# EAGLE design plc-3u-a (EAGLE 4.16)
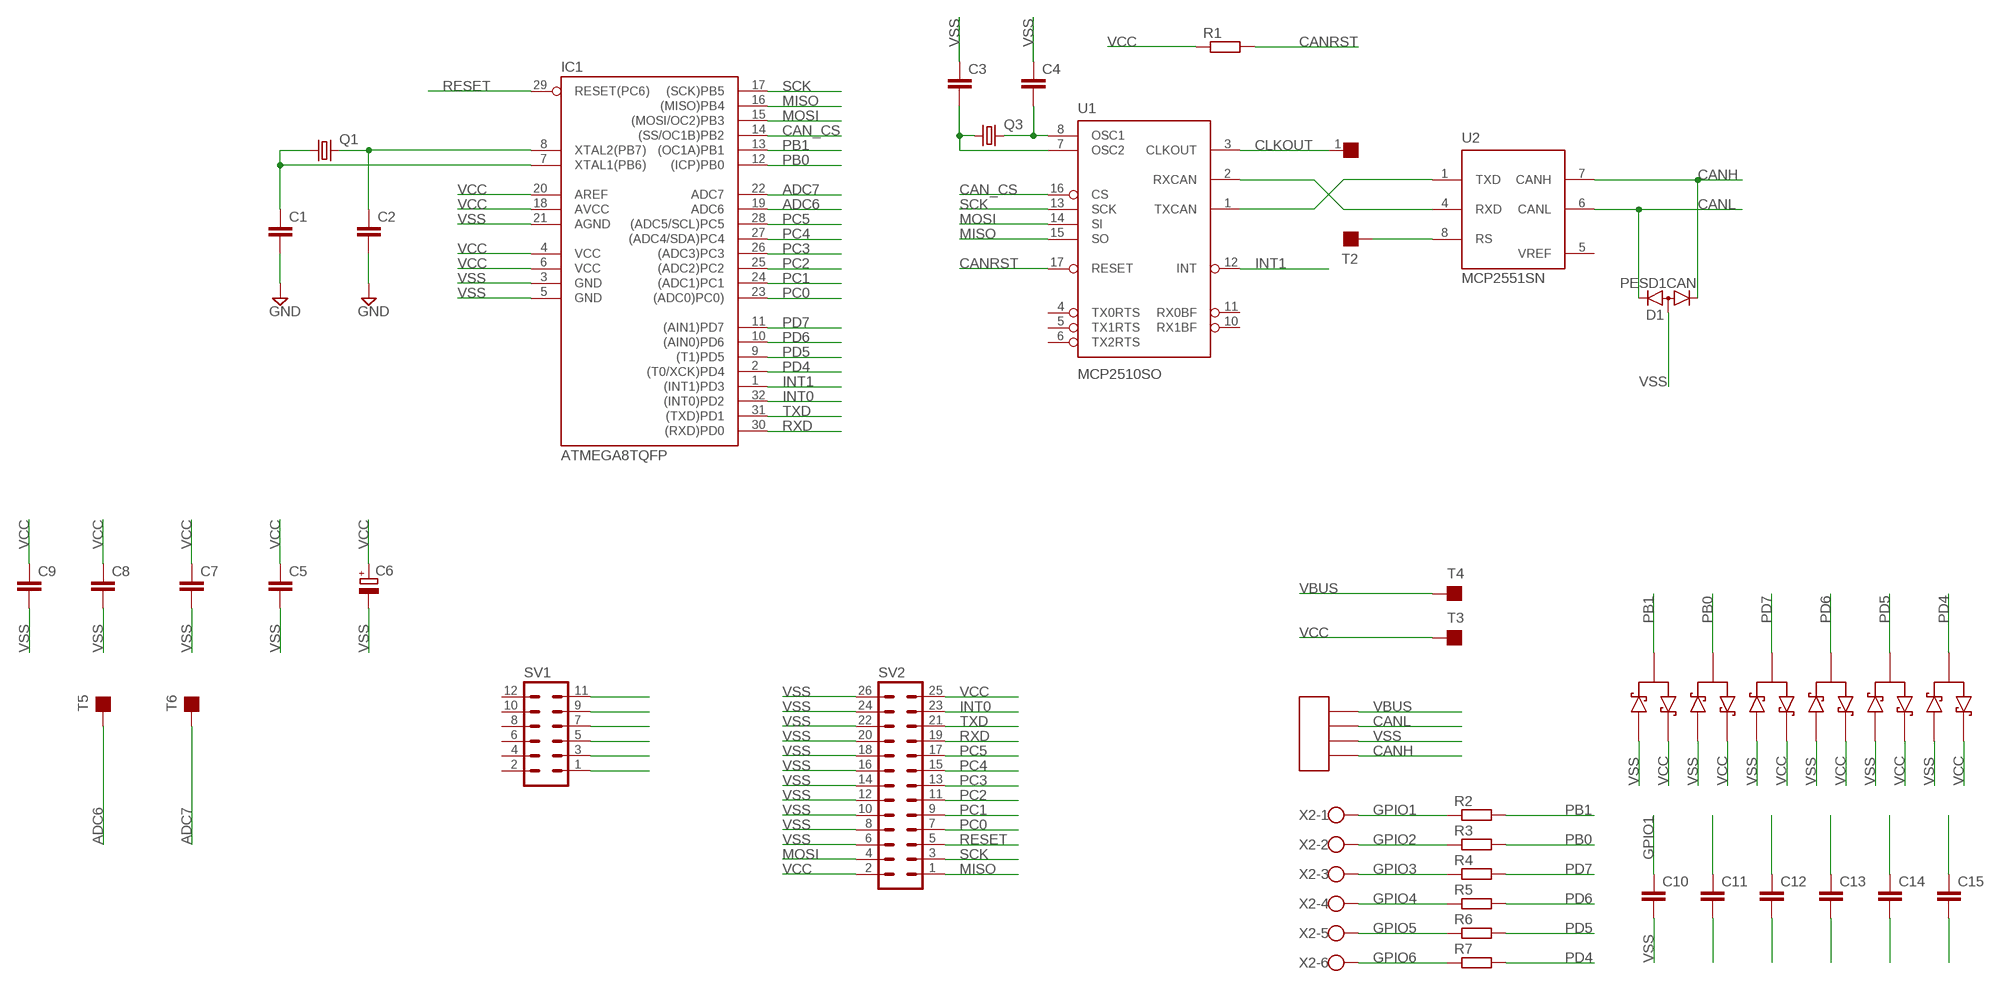
[diagram p0: schematic, sheet 1]

## Parts
C1  C-EUC0805  [C0805]
C2  C-EUC0805  [C0805]
C3  C-EUC0805  [C0805]
C4  C-EUC0805  [C0805]
C5  C-EUC0805  [C0805]
C6  CPOL-EUE2.5-5  [E2,5-5]
C7  C-EUC0805  [C0805]
C8  C-EUC0805  [C0805]
C9  C-EUC0805  [C0805]
C10  C-EUC1206  [C1206]
C11  C-EUC1206  [C1206]
C12  C-EUC1206  [C1206]
C13  C-EUC1206  [C1206]
C14  C-EUC1206  [C1206]
C15  C-EUC1206  [C1206]
D1  PESD1CAN  DIODEK2ASOT-23  [SOT-23]
IC1  ATMEGA8TQFP  [TQFP32-08]
Q1  CRYSTALHC49S  [HC49/S]
Q3  CRYSTALHC49S  [HC49/S]
R1  R-EU_R0805  [R0805]
R2  R-EU_R1206  [R1206]
R3  R-EU_R1206  [R1206]
R4  R-EU_R1206  [R1206]
R5  R-EU_R1206  [R1206]
R6  R-EU_R1206  [R1206]
R7  R-EU_R1206  [R1206]
SV1  MA06-2  [MA06-2]
SV2  MA13-2W  [MA13-2W]
T1  TESTPOINT  [TESTPOIN]
T2  TESTPOINT  [TESTPOIN]
T3  TESTPOINT  [TESTPOIN]
T4  TESTPOINT  [TESTPOIN]
T5  TESTPOINT  [TESTPOIN]
T6  TESTPOINT  [TESTPOIN]
U1  MCP2510SO  [SO-18W]
U2  MCP2551SN  [SO-08]
U$1  BAT54S  [SOT23]
U$2  BAT54S  [SOT23]
U$3  PIN_HEADER_2X2  [PIN_HEADER_2X2]
U$4  BAT54S  [SOT23]
U$5  BAT54S  [SOT23]
U$6  BAT54S  [SOT23]
U$7  BAT54S  [SOT23]
X2  W237-06P  [W237-6P]

## Nets
ADC6: IC1.19(ADC6) T5.1
ADC7: IC1.22(ADC7) T6.1
CAN_CS: IC1.14((SS/OC1B)PB2) U1.16(CS)
CANH: D1.1(K1) U2.7(CANH) U$3.P$4
CANL: D1.2(K2) U2.6(CANL) U$3.P$2
CANRST: R1.2 U1.17(RESET)
CLKOUT: T1.1 U1.3(CLKOUT)
GPIO1: C10.1 R2.1 X2.1
GPIO2: C11.1 R3.1 X2.2
GPIO3: C12.1 R4.1 X2.3
GPIO4: C13.1 R5.1 X2.4
GPIO5: C14.1 R6.1 X2.5
GPIO6: C15.1 R7.1 X2.6
INT0: IC1.32((INT0)PD2) SV2.23
INT1: IC1.1((INT1)PD3) U1.12(INT)
MISO: IC1.16((MISO)PB4) SV2.1 U1.15(SO)
MOSI: IC1.15((MOSI/OC2)PB3) SV2.4 U1.14(SI)
N$3: C4.2 Q3.2 U1.8(OSC1)
N$4: C3.2 Q3.1 U1.7(OSC2)
PB0: IC1.12((ICP)PB0) R3.2 SV1.3 U$2.3(MID)
PB1: IC1.13((OC1A)PB1) R2.2 SV1.1 U$1.3(MID)
PB6: C2.1 IC1.8(XTAL2(PB7)) Q1.2
PB7: C1.1 IC1.7(XTAL1(PB6)) Q1.1
PC0: IC1.23((ADC0)PC0)) SV2.7
PC1: IC1.24((ADC1)PC1) SV2.9
PC2: IC1.25((ADC2)PC2) SV2.11
PC3: IC1.26((ADC3)PC3) SV2.13
PC4: IC1.27((ADC4/SDA)PC4) SV2.15
PC5: IC1.28((ADC5/SCL)PC5) SV2.17
PD4: IC1.2((T0/XCK)PD4) R7.2 SV1.11 U$7.3(MID)
PD5: IC1.9((T1)PD5) R6.2 SV1.9 U$6.3(MID)
PD6: IC1.10((AIN0)PD6) R5.2 SV1.7 U$5.3(MID)
PD7: IC1.11((AIN1)PD7) R4.2 SV1.5 U$4.3(MID)
RESET: IC1.29(RESET(PC6)) SV2.5
RS: T2.1 U2.8(RS)
RX: U1.2(RXCAN) U2.4(RXD)
RXD: IC1.30((RXD)PD0) SV2.19
SCK: IC1.17((SCK)PB5) SV2.3 U1.13(SCK)
TX: U1.1(TXCAN) U2.1(TXD)
TXD: IC1.31((TXD)PD1) SV2.21
VBUS: T4.1 U$3.P$1
VCC: C5.1 C6.+ C7.1 C8.1 C9.1 IC1.4(VCC) IC1.6(VCC) IC1.18(AVCC) IC1.20(AREF) R1.1 SV2.2 SV2.25 T3.1 U$1.2(DST) U$2.2(DST) U$4.2(DST) U$5.2(DST) U$6.2(DST) U$7.2(DST)
VSS: C1.2 C2.2 C3.1 C4.1 C5.2 C6.- C7.2 C8.2 C9.2 C10.2 C11.2 C12.2 C13.2 C14.2 C15.2 D1.3(A) IC1.3(GND) IC1.5(GND) IC1.21(AGND) SV2.6 SV2.8 SV2.10 SV2.12 SV2.14 SV2.16 SV2.18 SV2.20 SV2.22 SV2.24 SV2.26 U$1.1(SRC) U$2.1(SRC) U$3.P$3 U$4.1(SRC) U$5.1(SRC) U$6.1(SRC) U$7.1(SRC) ; supply symbol labelled GND
Unconnected: SV1.2 SV1.4 SV1.6 SV1.8 SV1.10 SV1.12 U1.4(TX0RTS) U1.5(TX1RTS) U1.6(TX2RTS) U1.10(RX1BF) U1.11(RX0BF)

## Power pins joined to a net without a drawn wire
VCC: U1.18(VDD) U2.3(VDD)
VREF: U2.5(VREF)
VSS: U1.9(VSS) U2.2(VSS)

## Library data of the parts
C1-C5 C7-C15 = rcl:C-EU: CAPACITOR, European symbol
C6 = rcl:CPOL-EU: POLARIZED CAPACITOR, European symbol
D1 = ads4:DIODEK2A: Diode package with 2 cathodes (e.g., BAT54A)
IC1 = ads4:ATMEGA8TQFP: Atmel ATmega8 in the TQFP package
Q1 Q3 = crystal:CRYSTAL: CRYSTAL
R1-R7 = rcl:R-EU_: RESISTOR, European symbol
SV1 = con-lstb:MA06-2: PIN HEADER
SV2 = con-lstb:MA13-2W: PIN HEADER
T1 = ADS:TESTPOINT
T2-T6 = ads4:TESTPOINT: Test point
U1 = microchip_can:MCP2510
U2 = microchip_can:MCP2551: High Speed CAN tranceiver
U$1 U$2 U$4-U$7 = my-protection:BAT54S
U$3 = my:PIN_HEADER_2X2
X2 = con-wago-508:W237-06P: WAGO SREW CLAMP

## Board
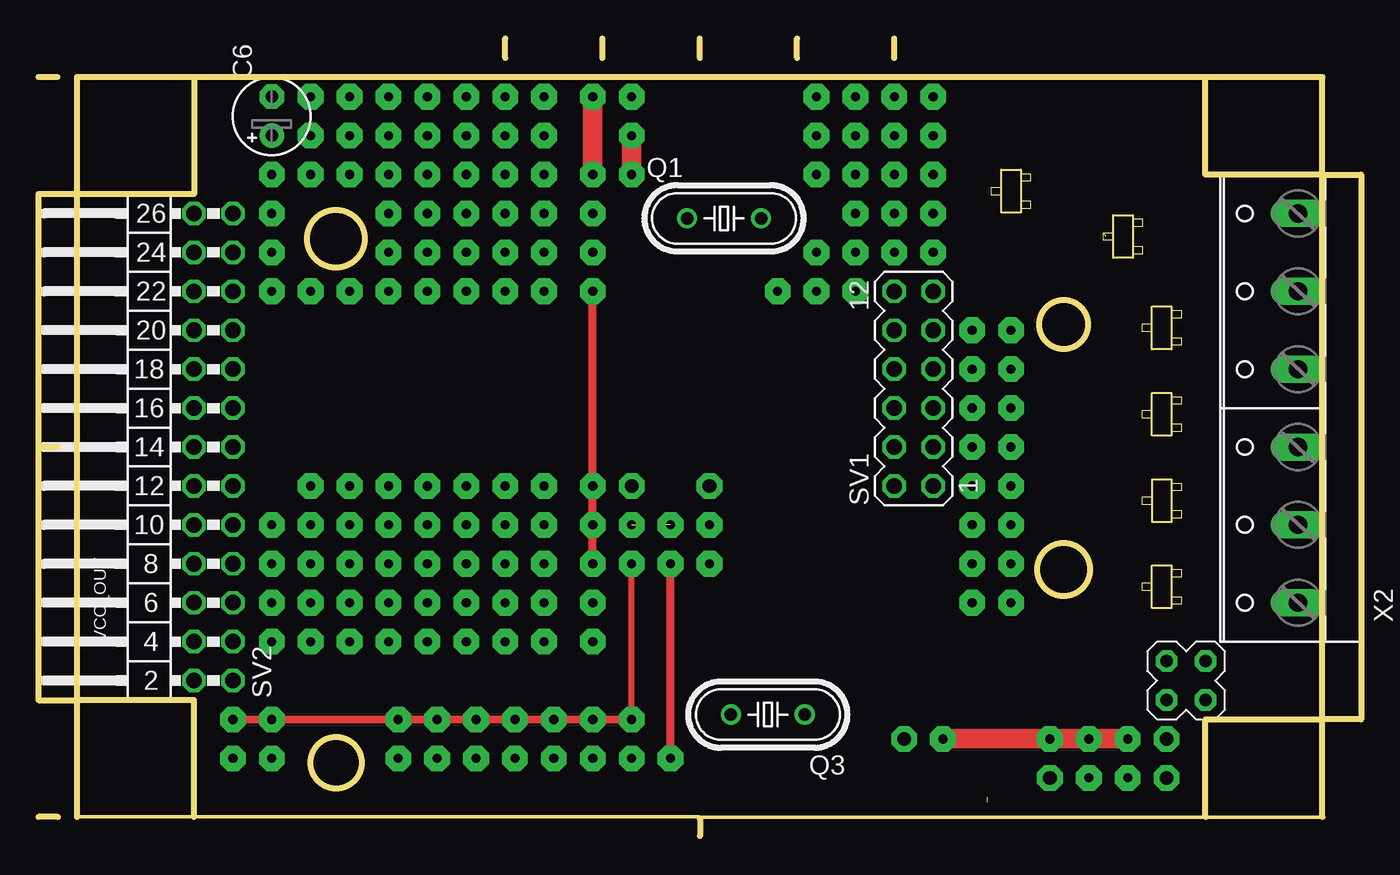
[diagram p1: board, top side]
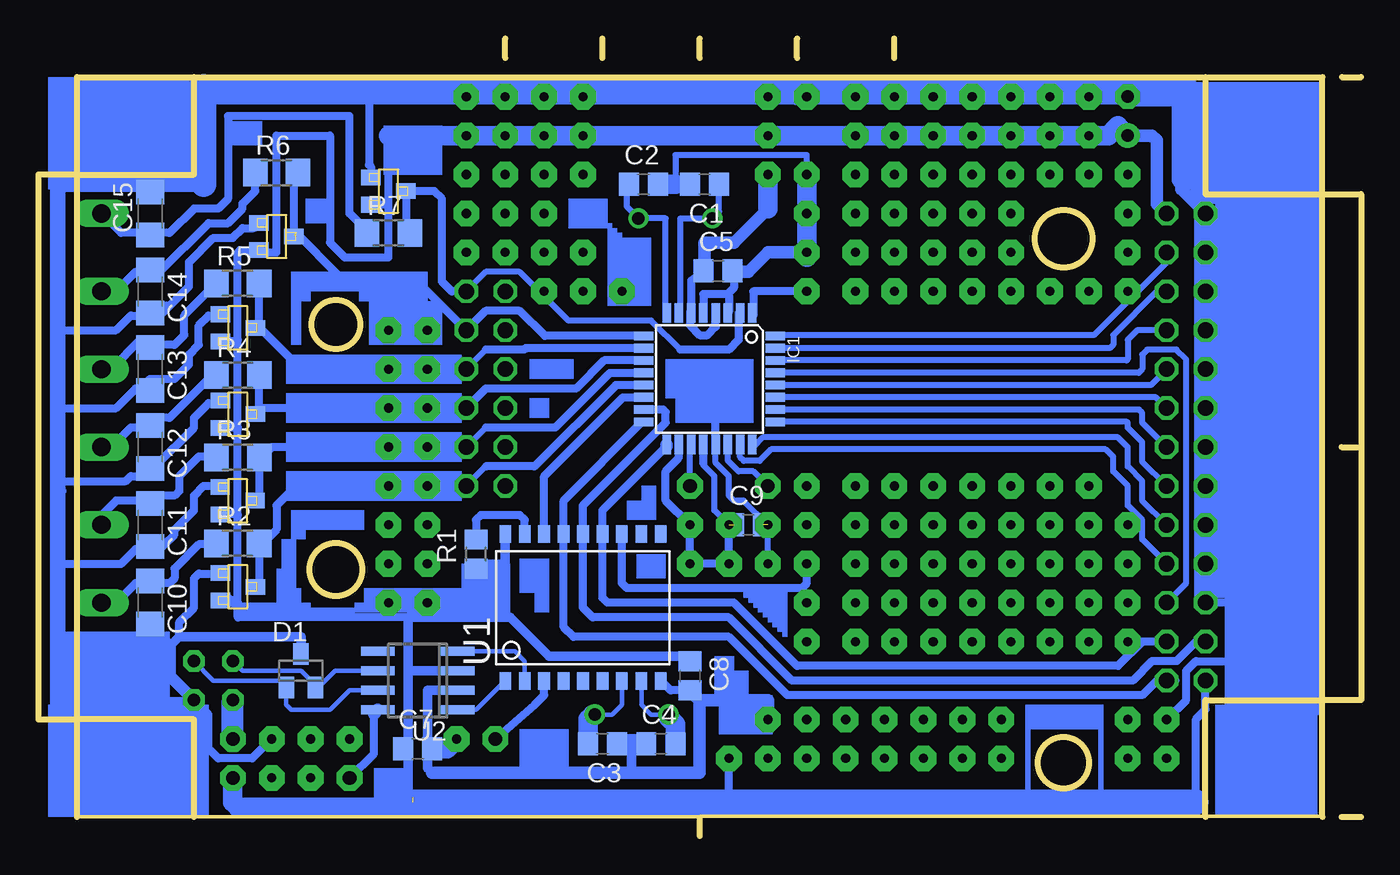
[diagram p2: board, bottom side, seen from below]

Size 86.36 x 52.07 mm. Coordinates in mm from the lower left corner, seen from the top.
Outline: 2.54,1.29 83.82,1.25
Outline: 43.18,1.13 43.18,0
Outline: 1.27,49.53 0,49.53
Outline: 1.27,1.27 0,1.27
Outline: 1.27,25.4 0,25.4
Outline: 2.54,1.27 2.54,8.89
Outline: 2.54,8.89 2.54,41.91
Outline: 2.54,41.91 2.54,49.53 10.16,49.53
Outline: 83.82,1.27 83.82,7.62
Outline: 83.82,7.62 83.82,43.18
Outline: 83.82,43.18 83.82,49.53 76.2,49.53
Outline: 76.2,49.53 10.16,49.53
Outline: 10.16,1.27 10.16,8.89 2.54,8.89
Outline: 76.2,1.27 76.2,7.62 83.82,7.62
Outline: 83.82,43.18 76.2,43.18 76.2,49.53
Outline: 10.16,49.53 10.16,41.91 2.54,41.91
Outline: 2.54,41.91 0,41.91 0,8.89 2.54,8.89
Outline: 83.82,43.18 86.36,43.18 86.36,7.62 83.82,7.62
Outline: 43.18,50.8 43.18,52.07
Outline: 49.53,50.8 49.53,52.07
Outline: 55.88,50.8 55.88,52.07
Outline: 36.83,50.8 36.83,52.07
Outline: 30.48,50.8 30.48,52.07
Outline: circle at 19.43,39 radius 1.86
Outline: circle at 19.43,4.8 radius 1.66
Outline: circle at 66.93,17.4 radius 1.71
Outline: circle at 66.93,33.4 radius 1.57
Copper layers (1*16): Top 0.035mm / dielectric 1.5mm / Bottom 0.035mm
Design rules "default": minimum track width 10mil, minimum drill 24mil, track to track 8mil, track to pad 8mil, pad to pad 8mil, via to via 8mil, smd to smd 8mil, copper to edge 40mil, drill to drill 8mil, minimum pad ring 10mil, minimum via ring 8mil, stop-mask expansion 4mil, vias tented up to drill 0mil, thermal gap 10mil

### Footprints (pad centres in the part's own frame; a part is rotated, then mirrored left to right if it is on the bottom)
C0805 = smd 1.3 x 1.5: 1 -0.95,0; 2 0.95,0
E2,5-5 = drill 0.813 pad 1.6 round: + -1.27,0 | drill 0.813 pad 1.6 octagon: - 1.27,0
C1206 = smd 1.6 x 1.8: 1 -1.4,0; 2 1.4,0
SOT-23 = smd 1 x 1.4: 1 -0.95,-1.1; 2 0.95,-1.1; 3 0,1.1
TQFP32-08 = smd 1.27 x 0.559: 1 -4.293,2.8; 2 -4.293,2; 3 -4.293,1.2; 4 -4.293,0.4; 5 -4.293,-0.4; 6 -4.293,-1.2; 7 -4.293,-2; 8 -4.293,-2.8; 17 4.293,-2.8; 18 4.293,-2; 19 4.293,-1.2; 20 4.293,-0.4; 21 4.293,0.4; 22 4.293,1.2; 23 4.293,2; 24 4.293,2.8 | smd 0.559 x 1.27: 9 -2.8,-4.293; 10 -2,-4.293; 11 -1.2,-4.293; 12 -0.4,-4.293; 13 0.4,-4.293; 14 1.2,-4.293; 15 2,-4.293; 16 2.8,-4.293; 25 2.8,4.293; 26 2,4.293; 27 1.2,4.293; 28 0.4,4.293; 29 -0.4,4.293; 30 -1.2,4.293; 31 -2,4.293; 32 -2.8,4.293
HC49/S = drill 0.813 round: 1 -2.413,0; 2 2.413,0
R0805 = smd 1.3 x 1.5: 1 -0.95,0; 2 0.95,0
R1206 = smd 1.6 x 1.8: 1 -1.4,0; 2 1.4,0
MA06-2 = drill 1.016 octagon: 1 -6.35,-1.27; 2 -6.35,1.27; 3 -3.81,-1.27; 4 -3.81,1.27; 5 -1.27,-1.27; 6 -1.27,1.27; 7 1.27,-1.27; 8 1.27,1.27; 9 3.81,-1.27; 10 3.81,1.27; 11 6.35,-1.27; 12 6.35,1.27
MA13-2W = drill 1.016 octagon: 1 -15.24,-1.27; 2 -15.24,1.27; 3 -12.7,-1.27; 4 -12.7,1.27; 5 -10.16,-1.27; 6 -10.16,1.27; 7 -7.62,-1.27; 8 -7.62,1.27; 9 -5.08,-1.27; 10 -5.08,1.27; 11 -2.54,-1.27; 12 -2.54,1.27; 13 0,-1.27; 14 0,1.27; 15 2.54,-1.27; 16 2.54,1.27; 17 5.08,-1.27; 18 5.08,1.27; 19 7.62,-1.27; 20 7.62,1.27; 21 10.16,-1.27; 22 10.16,1.27; 23 12.7,-1.27; 24 12.7,1.27; 25 15.24,-1.27; 26 15.24,1.27
TESTPOIN = drill 0.889 pad 1.676 octagon: 1 0,0
SO-18W = smd 0.762 x 1.143: 1 -5.08,-4.788; 2 -3.81,-4.788; 3 -2.54,-4.788; 4 -1.27,-4.788; 5 0,-4.788; 6 1.27,-4.788; 7 2.54,-4.788; 8 3.81,-4.788; 9 5.08,-4.788; 10 5.08,4.788; 11 3.81,4.788; 12 2.54,4.788; 13 1.27,4.788; 14 0,4.788; 15 -1.27,4.788; 16 -2.54,4.788; 17 -3.81,4.788; 18 -5.08,4.788
SO-08 = smd 0.6 x 2.2: 1 -1.905,-2.6; 2 -0.635,-2.6; 3 0.635,-2.6; 4 1.905,-2.6; 5 1.905,2.6; 6 0.635,2.6; 7 -0.635,2.6; 8 -1.905,2.6
SOT23 = smd 1.016 x 1.27: 1 -0.889,-1.143; 2 0.889,-1.143; 3 0,1.143
PIN_HEADER_2X2 = drill 0.8 pad 1.422 octagon: P$1 -1.27,-1.27; P$2 -1.27,1.27; P$3 1.27,-1.27; P$4 1.27,1.27
W237-6P = drill 1.194 long: 1 -12.7,-0.635; 2 -7.62,-0.635; 3 -2.54,-0.635; 4 2.54,-0.635; 5 7.62,-0.635; 6 12.7,-0.635

### Placement (x,y rotation side)
C1  42.86,42.55 180 bottom
C2  46.85,42.55 0 bottom
C3  49.53,6.03 180 bottom
C4  45.72,6.03 0 bottom
C5  41.98,36.89 0 bottom
C6  15.24,46.99 90 top
C7  61.59,5.71 0 bottom
C8  43.81,10.48 270 bottom
C9  40.01,20.32 0 bottom
C10  79.06,15.24 270 bottom
C11  79.06,20.32 270 bottom
C12  79.06,25.4 270 bottom
C13  79.06,30.48 270 bottom
C14  79.06,35.56 270 bottom
C15  79.06,40.64 90 bottom
D1  69.22,10.79 0 bottom
IC1  42.55,29.84 270 bottom
Q1  44.77,40.32 0 top
Q3  47.62,7.94 180 top
R1  57.78,18.41 90 bottom
R2  73.34,19.11 0 bottom
R3  73.34,24.72 0 bottom
R4  73.34,30.09 0 bottom
R5  73.34,36.08 0 bottom
R6  70.8,43.3 0 bottom
R7  63.5,39.37 0 bottom
SV1  57.15,29.21 90 top
SV2  11.43,25.4 90 top
T1  56.52,6.35 0 top
T2  66.04,3.81 0 top
T3  73.66,3.81 0 top
T4  73.66,6.35 0 top
T5  43.81,22.86 0 top
T6  38.73,22.86 0 top
U1  50.8,14.92 0 bottom
U2  61.59,10.16 90 bottom
U$1  73.34,16.28 270 bottom
U$2  73.35,21.9 270 bottom
U$3  74.93,10.16 0 top
U$4  73.34,27.54 270 bottom
U$5  73.34,33.17 270 bottom
U$6  70.81,39.14 270 bottom
U$7  63.5,42.1 270 bottom
X2  81.6,27.94 90 top

### Tracks (layer width: path | path; a pad name or v marks a point on that pad's centre or on a via)
ADC6
  Bottom 0.406: IC1.19 43.74,25.47 43.81,25.4 T5.1
ADC7
  Bottom 0.406: IC1.22 41.34,24.52 40.64,23.81 39.69,23.81 T6.1
CAN_CS
  Bottom 0.508: IC1.14 48.19,28.64 53.34,23.5 U1.16 53.34,19.68
CANH
  Bottom 0.305: U2.7 66.04,9.53 67.31,8.26 69.85,8.26 70.17,8.57 70.17,9.53 D1.1 70.17,9.84 70.48,10.16 74.93,10.16 U$3.P$4
CANL
  Bottom 0.305: U2.6 66.99,10.79 68.26,9.53 68.27,9.53 D1.2 68.27,9.85 69.22,10.79 73.03,10.79 U$3.P$2
CANRST
  Bottom 0.508: U1.17 54.61,20.64 54.93,20.95 57.47,20.95 57.78,20.64 R1.2
CLKOUT
  Bottom 0.508: U1.3 53.34,9.21 53.98,8.57 T1.1
GPIO1
  Bottom 0.508: R2.1 74.74,19.18 74.93,19.37 75.25,19.05 75.88,19.05 77.47,17.46 77.47,16.83 77.79,16.51 79.06,16.51 | 79.06,16.51 C10.1 | 79.06,16.51 80.01,16.51 81.28,15.24 X2.1
GPIO2
  Bottom 0.508: 74.7,24.77 74.61,24.77 | R3.1 74.7,24.77 | 74.7,24.77 75.88,24.77 77.15,23.5 77.15,22.54 77.47,22.23 78.55,22.23 C11.1 79.25,21.91 81.28,21.91 82.23,20.95 X2.2
GPIO3
  Bottom 0.508: C12.1 79.19,26.67 80.33,26.67 81.28,25.72 81.28,25.4 X2.3 | 74.98,29.84 R4.1 74.67,30.16 | C12.1 79.06,26.67 | C12.1 78.55,27.3 77.79,27.3 74.93,30.16 74.67,30.16 | 74.67,30.16 74.61,30.16
GPIO4
  Bottom 0.508: 79.06,32.07 79.06,32.38 | X2.4 81.6,30.48 79.69,32.38 79.19,32.38 C13.1 79.06,32.07 | R5.1 76.84,33.99 76.84,32.7 77.47,32.07 79.06,32.07
GPIO5
  Bottom 0.508: R6.1 72.2,42.1 73.03,41.27 73.03,40.96 73.98,40.01 75.25,40.01 78.42,36.83 79.06,36.83 C14.1 79.19,36.83 80.01,36.83 81.28,35.56 X2.5
GPIO6
  Bottom 0.508: R7.1 64.9,39.5 66.04,40.64 66.04,46.99 73.98,46.99 73.98,41.59 74.61,40.96 76.2,40.96 77.79,39.37 79.06,39.37 C15.1 79.19,39.37 80.96,39.37 X2.6 81.92,40.96
INT0
  Bottom 0.406: SV2.23 12.7,37.47 17.46,32.7 38.1,32.7 38.16,32.65 IC1.32
INT1  (via drill 0.6 pad 1.68)
  Top 0.508: v36.2,17.78 v36.2,20.32 v36.2,22.86 v36.2,35.56
  Bottom 0.508: U1.12 48.26,16.51 47.94,16.19 36.51,16.19 36.2,16.51 v36.2,17.78 | 39.69,34.29 39.69,34.2 IC1.1 39.74,34.03 39.69,33.97 39.69,35.56 v36.2,35.56
MISO
  Bottom 0.406: SV2.1 12.07,10.16
  Bottom 0.508: IC1.16 46.93,27.05 52.07,21.91 U1.15 52.07,13.65 51.44,13.02 41.27,13.02 37.46,9.21 14.29,9.21 13.34,10.16 SV2.1
MOSI
  Bottom 0.508: IC1.15 46.81,27.84 46.8,27.84 45.56,27.84 45.4,27.68 45.4,26.99 50.8,21.59 U1.14 50.8,14.92 50.16,14.29 41.27,14.29 37.15,10.16 14.92,10.16 13.65,11.43 12.07,11.43 10.8,12.7 SV2.4
N$3
  Bottom 0.305: Q3.2 46.35,7.94 46.99,8.57 U1.8 46.99,10.16
  Bottom 1.27: Q3.2 45.21,7.75 44.77,7.3 C4.2
N$4
  Bottom 0.305: Q3.1 48.89,7.94 48.26,8.57 U1.7 48.26,10.16
  Bottom 1.27: Q3.1 50.16,7.94 50.48,7.62 C3.2
N$6  (via drill 0.6 pad 1.68)
  other vias: 43.81,17.78
N$7  (via drill 0.6 pad 1.68)
  other vias: 43.81,20.32
N$8  (via drill 0.6 pad 1.68)
  other vias: 33.02,48.26
N$9  (via drill 0.6 pad 1.68)
  other vias: 33.02,43.18
N$10  (via drill 0.6 pad 1.68)
  other vias: 38.73,48.26
N$11  (via drill 0.6 pad 1.68)
  other vias: 33.02,40.64
N$12  (via drill 0.6 pad 1.68)
  other vias: 33.02,38.1
N$13  (via drill 0.6 pad 1.68)
  other vias: 33.02,35.56
N$14  (via drill 0.6 pad 1.68)
  other vias: 30.48,35.56
N$15  (via drill 0.6 pad 1.68)
  other vias: 27.94,35.56
N$16  (via drill 0.6 pad 1.68)
  other vias: 25.4,35.56
N$17  (via drill 0.6 pad 1.68)
  other vias: 30.48,38.1
N$18  (via drill 0.6 pad 1.68)
  other vias: 30.48,40.64
N$19  (via drill 0.6 pad 1.68)
  other vias: 27.94,40.64
N$20  (via drill 0.6 pad 1.68)
  other vias: 27.94,38.1
N$21  (via drill 0.6 pad 1.68)
  other vias: 25.4,38.1
N$22  (via drill 0.6 pad 1.68)
  other vias: 25.4,40.64
N$23  (via drill 0.6 pad 1.68)
  other vias: 22.86,40.64
N$24  (via drill 0.6 pad 1.68)
  other vias: 22.86,38.1
N$25  (via drill 0.6 pad 1.68)
  other vias: 22.86,35.56
N$26  (via drill 0.6 pad 1.68)
  other vias: 20.32,35.56
N$27  (via drill 0.6 pad 1.68)
  other vias: 17.78,35.56
N$28  (via drill 0.6 pad 1.68)
  other vias: 15.24,35.56
N$29  (via drill 0.6 pad 1.68)
  other vias: 22.86,43.18
N$30  (via drill 0.6 pad 1.68)
  other vias: 25.4,43.18
N$31  (via drill 0.6 pad 1.68)
  other vias: 27.94,43.18
N$32  (via drill 0.6 pad 1.68)
  other vias: 20.32,43.18
N$33  (via drill 0.6 pad 1.68)
  other vias: 17.78,43.18
N$34  (via drill 0.6 pad 1.68)
  other vias: 15.24,43.18
N$35  (via drill 0.6 pad 1.68)
  other vias: 22.86,48.26
N$36  (via drill 0.6 pad 1.68)
  other vias: 25.4,48.26
N$37  (via drill 0.6 pad 1.68)
  other vias: 27.94,48.26
N$38  (via drill 0.6 pad 1.68)
  other vias: 30.48,48.26
N$39  (via drill 0.6 pad 1.68)
  other vias: 30.48,43.18
N$40  (via drill 0.6 pad 1.68)
  other vias: 15.24,38.1
N$41  (via drill 0.6 pad 1.68)
  other vias: 15.24,40.64
N$42  (via drill 0.6 pad 1.68)
  other vias: 15.24,15.24
N$43  (via drill 0.6 pad 1.68)
  other vias: 17.78,15.24
N$44  (via drill 0.6 pad 1.68)
  other vias: 15.24,17.78
N$45  (via drill 0.6 pad 1.68)
  other vias: 17.78,17.78
N$46  (via drill 0.6 pad 1.68)
  other vias: 17.78,20.32
N$47  (via drill 0.6 pad 1.68)
  other vias: 15.24,20.32
N$48  (via drill 0.6 pad 1.68)
  other vias: 17.78,22.86
N$49  (via drill 0.6 pad 1.68)
  other vias: 20.32,22.86
N$50  (via drill 0.6 pad 1.68)
  other vias: 20.32,20.32
N$51  (via drill 0.6 pad 1.68)
  other vias: 22.86,22.86
N$52  (via drill 0.6 pad 1.68)
  other vias: 25.4,22.86
N$53  (via drill 0.6 pad 1.68)
  other vias: 22.86,20.32
N$54  (via drill 0.6 pad 1.68)
  other vias: 25.4,20.32
N$55  (via drill 0.6 pad 1.68)
  other vias: 27.94,22.86
N$56  (via drill 0.6 pad 1.68)
  other vias: 30.48,22.86
N$57  (via drill 0.6 pad 1.68)
  other vias: 33.02,22.86
N$58  (via drill 0.6 pad 1.68)
  other vias: 27.94,20.32
N$59  (via drill 0.6 pad 1.68)
  other vias: 30.48,20.32
N$60  (via drill 0.6 pad 1.68)
  other vias: 33.02,20.32
N$61  (via drill 0.6 pad 1.68)
  other vias: 38.73,5.08
N$62  (via drill 0.6 pad 1.68)
  other vias: 36.2,5.08
N$63  (via drill 0.6 pad 1.68)
  other vias: 33.66,5.08
N$64  (via drill 0.6 pad 1.68)
  other vias: 31.11,5.08
N$65  (via drill 0.6 pad 1.68)
  other vias: 28.57,5.08
N$66  (via drill 0.6 pad 1.68)
  other vias: 26.04,5.08
N$67  (via drill 0.6 pad 1.68)
  other vias: 23.49,5.08
N$68  (via drill 0.6 pad 1.68)
  other vias: 15.24,5.08
N$69  (via drill 0.6 pad 1.68)
  other vias: 12.7,5.08
N$70  (via drill 0.6 pad 1.68)
  other vias: 20.32,17.78
N$71  (via drill 0.6 pad 1.68)
  other vias: 20.32,15.24
N$72  (via drill 0.6 pad 1.68)
  other vias: 20.32,12.7
N$73  (via drill 0.6 pad 1.68)
  other vias: 17.78,12.7
N$74  (via drill 0.6 pad 1.68)
  other vias: 15.24,12.7
N$75  (via drill 0.6 pad 1.68)
  other vias: 22.86,12.7
N$76  (via drill 0.6 pad 1.68)
  other vias: 25.4,12.7
N$77  (via drill 0.6 pad 1.68)
  other vias: 25.4,15.24
N$78  (via drill 0.6 pad 1.68)
  other vias: 27.94,12.7
N$79  (via drill 0.6 pad 1.68)
  other vias: 27.94,15.24
N$80  (via drill 0.6 pad 1.68)
  other vias: 22.86,15.24
N$81  (via drill 0.6 pad 1.68)
  other vias: 22.86,17.78
N$82  (via drill 0.6 pad 1.68)
  other vias: 25.4,17.78
N$83  (via drill 0.6 pad 1.68)
  other vias: 27.94,17.78
N$84  (via drill 0.6 pad 1.68)
  other vias: 30.48,17.78
N$85  (via drill 0.6 pad 1.68)
  other vias: 30.48,15.24
N$86  (via drill 0.6 pad 1.68)
  other vias: 30.48,12.7
N$87  (via drill 0.6 pad 1.68)
  other vias: 33.02,12.7
N$88  (via drill 0.6 pad 1.68)
  other vias: 33.02,15.24
N$89  (via drill 0.6 pad 1.68)
  other vias: 33.02,17.78
N$90  (via drill 0.6 pad 1.68)
  other vias: 36.2,15.24
N$91  (via drill 0.6 pad 1.68)
  other vias: 36.2,12.7
N$92  (via drill 0.6 pad 1.68)
  other vias: 53.34,35.56
N$93  (via drill 0.6 pad 1.68)
  other vias: 50.8,35.56
N$94  (via drill 0.6 pad 1.68)
  other vias: 48.26,35.56
N$95  (via drill 0.6 pad 1.68)
  other vias: 50.8,38.1
N$96  (via drill 0.6 pad 1.68)
  other vias: 53.34,38.1
N$97  (via drill 0.6 pad 1.68)
  other vias: 53.34,40.64
N$98  (via drill 0.6 pad 1.68)
  other vias: 55.88,38.1
N$99  (via drill 0.6 pad 1.68)
  other vias: 55.88,40.64
N$100  (via drill 0.6 pad 1.68)
  other vias: 53.34,43.18
N$101  (via drill 0.6 pad 1.68)
  other vias: 50.8,43.18
N$102  (via drill 0.6 pad 1.68)
  other vias: 55.88,43.18
N$103  (via drill 0.6 pad 1.68)
  other vias: 58.42,43.18
N$104  (via drill 0.6 pad 1.68)
  other vias: 58.42,40.64
N$105  (via drill 0.6 pad 1.68)
  other vias: 58.42,38.1
N$106  (via drill 0.6 pad 1.68)
  other vias: 50.8,48.26
N$107  (via drill 0.6 pad 1.68)
  other vias: 53.34,48.26
N$108  (via drill 0.6 pad 1.68)
  other vias: 55.88,48.26
N$109  (via drill 0.6 pad 1.68)
  other vias: 58.42,48.26
N$110  (via drill 0.6 pad 1.68)
  other vias: 17.78,48.26
N$111  (via drill 0.6 pad 1.68)
  other vias: 20.32,48.26
N$112  (via drill 0.6 pad 1.68)
  other vias: 60.96,20.32
N$113  (via drill 0.6 pad 1.68)
  other vias: 71.12,3.81
N$114  (via drill 0.6 pad 1.68)
  other vias: 68.58,3.81
N$115  (via drill 0.6 pad 1.68)
  other vias: 60.96,17.78
N$116  (via drill 0.6 pad 1.68)
  other vias: 60.96,15.24
N$117  (via drill 0.6 pad 1.68)
  other vias: 63.5,15.24
N$118  (via drill 0.6 pad 1.68)
  other vias: 63.5,17.78
N$119  (via drill 0.6 pad 1.68)
  other vias: 63.5,20.32
N$120  (via drill 0.6 pad 1.68)
  other vias: 60.96,33.02
N$121  (via drill 0.6 pad 1.68)
  other vias: 63.5,33.02
PB0  (via drill 0.6 pad 1.68)
  Bottom 0.406: 57.15,26.67 SV1.3 | 46.84,30.23 IC1.12
  Bottom 0.508: 57.15,26.67 52.61,26.67 49.05,30.23 46.84,30.23 | U$2.3 72.08,21.9 71.94,22.04 R3.2 71.8,24.72 71.12,25.4 v63.5,25.4 v60.96,25.4 SV1.3
PB1  (via drill 0.6 pad 1.68)
  Bottom 0.406: 57.15,24.13 SV1.1
  Bottom 0.508: IC1.13 48.66,29.45 53.98,24.13 57.15,24.13 | U$1.3 72.16,16.28 72.07,16.19 71.94,16.32 R2.2 71.82,19.11 71.76,19.05 70.8,20 70.8,21.59 69.53,22.86 v63.5,22.86 v60.96,22.86 SV1.1
PB6
  Bottom 0.406: IC1.8 45.4,34.2 45.4,40.32 Q1.2 | Q1.2 47.31,40.32 | C2.1 47.94,42.55 47.94,41.08 Q1.2
PB7
  Bottom 0.406: IC1.7 44.45,34.23 44.45,40.32 Q1.1 | Q1.1 42.23,40.32 | C1.1 41.91,40.77 Q1.1
PC0
  Bottom 0.406: IC1.23 40.55,24.75 40.3,24.5 39.28,24.5 38.53,25.25 16.67,25.25 16.19,24.77 16.19,23.81 15.24,22.86 15.24,21.59 14.29,20.64 14.29,19.37 SV2.7
PC1
  Bottom 0.406: SV2.9 14.29,21.91 14.29,23.18 15.24,24.13 15.24,25.4 15.88,26.04 39.05,26.04 39.69,25.4 39.74,25.46 IC1.24
PC2
  Bottom 0.406: IC1.25 15.3,27.05 15.24,26.99 15.24,26.67 14.29,25.72 14.29,24.45 SV2.11
PC3
  Bottom 0.406: IC1.26 14.51,27.84 14.29,27.62 14.29,26.99 SV2.13
PC4
  Bottom 0.406: IC1.27 13.41,28.64 SV2.15
PC5
  Bottom 0.406: IC1.28 13.73,29.45 SV2.17
PD4
  Bottom 0.406: SV1.11 57.15,36.83 54.93,36.83 51.75,33.66 46.35,33.66 44.45,31.75
  Bottom 0.508: IC1.2 40.64,34.14 40.64,32.38 41.27,31.75 44.45,31.75 | SV1.11 59.37,35.56 60.01,36.2 60.01,41.59 60.51,42.1 U$7.3 62.36,39.5 62.23,39.37 R7.2
PD5  (1 unrouted)
  Bottom 0.508: IC1.9 53.28,32.65 54.93,34.29 57.15,34.29 SV1.9 61.91,36.51 66.68,36.51 69.53,39.37 | R6.2 69.34,43.3 69.22,43.18 69.67,42.73 69.67,39.19 69.62,39.14 | 69.62,39.14 69.53,39.05 | U$6.3 69.62,39.14
PD6  (via drill 0.6 pad 1.68)
  Bottom 0.406: 57.15,31.75 SV1.7 | 46.99,31.75 46.89,31.84 IC1.10
  Bottom 0.508: 57.15,31.75 54.62,31.75 54.52,31.84 IC1.10 | R5.2 71.94,33.15 72.07,33.02 72.2,33.15 U$5.3 71.91,33.17 69.22,30.48 v63.5,30.48 v60.96,30.48 SV1.7
PD7  (via drill 0.6 pad 1.68)
  Bottom 0.406: IC1.11
  Bottom 0.508: IC1.11 49.42,31.05 51.26,29.21 57.15,29.21 SV1.5 v60.96,27.94 v63.5,27.94 71.76,27.94 72.07,27.62 | R4.2 71.94,27.76 72.07,27.62 | 72.07,27.62 72.15,27.54 U$4.3
RESET
  Bottom 0.406: SV2.5 11.43,16.51 11.43,31.11 12.07,31.75 13.97,31.75 14.29,31.43 14.29,30.48 14.52,30.25 IC1.29
RS
  Bottom 0.508: 64.45,8 64.45,5.4 T2.1
  Bottom 0.813: 64.45,8 U2.8
RX
  Bottom 0.305: U2.4 55.24,12.06 54.61,11.43 U1.2
RXD
  Bottom 0.406: IC1.30 15.31,31.05 15.24,31.11 15.24,32.38 14.61,33.02 SV2.19
SCK
  Bottom 0.508: 45.34,25.46 49.53,21.27 U1.13 49.53,15.56 49.21,15.24 40.96,15.24 36.83,11.11 15.88,11.11 14.29,12.7 SV2.3
  Bottom 0.813: 45.34,25.46 IC1.17
TX
  Bottom 0.305: U1.1 55.88,10.16 57.78,8.26 U2.1
TXD
  Bottom 0.406: IC1.31 16.41,31.84 16.19,32.07 16.19,32.7 13.34,35.56 SV2.21
VBUS
  Bottom 1.422: T4.1 U$3.P$1
VCC  (via drill 0.6 pad 1.68)  (2 unrouted)
  Top 0.508: v41.27,5.08 v41.27,17.78
  Top 1.27: v38.73,45.72 v38.73,43.18
  Bottom 0.406: IC1.4 42.23,34.14 | IC1.6 43.81,34.21 | 44.57,24.68 44.56,24.68 44.54,24.7 44.55,24.71 | 42.95,24.34 42.95,24.21 42.23,23.5 42.23,21.27 v41.27,20.32
  Bottom 0.508: SV2.2 10.16,8.26 10.8,7.62 10.8,2.22 | R1.1 57.47,17.78 55.88,17.78 | 44.57,24.68 45.4,23.81 45.4,21.91 43.81,20.32 43.81,17.78 v41.27,17.78 v41.27,20.32 | 41.27,2.22 v41.27,5.08 | 43.81,34.21 43.81,33.34 43.18,32.7 42.67,32.7 42.14,33.23 42.14,34.09 42.13,34.1 42.14,34.12 IC1.4 | 44.55,24.71 IC1.18 | 42.95,24.34 IC1.20 | 43.74,34.11 IC1.6 43.74,36.26 C5.1 | 62.23,14.29 73.34,14.29 | 73.34,14.29 73.34,15.24 | 73.34,15.24 73.34,20.95 | 73.34,20.95 73.34,26.67 | 73.34,26.67 73.34,32.38 | 73.34,32.38 73.34,38.1 73.19,38.25 U$6.2 71.96,38.22 72.07,38.1 70.8,38.1 70.8,45.72 | 63.5,41.27 63.5,45.72 | 63.5,41.27 63.5,37.78 66.36,37.78 67.31,38.73 67.31,45.72 70.8,45.72 | U$7.2 63.57,41.21 63.5,41.27 | 70.8,45.72 70.8,45.73 | U$5.2 73.44,32.29 73.34,32.38 | 73.34,26.67 73.36,26.65 | 73.34,14.29 73.34,14.92 73.98,15.56 74.3,15.56 74.46,15.39 U$1.2 73.49,15.39 73.34,15.24 | U$2.2 73.4,21.01 73.34,20.95 | U$4.2 74.47,26.67 73.34,26.67
  Bottom 0.61: 62.23,5.71 62.23,2.54 | 62.23,10.79 62.23,5.71 | 62.23,10.79 U2.3 | 55.88,14.29 55.88,17.78 U1.18 | 55.88,14.29 62.23,14.29 62.23,10.79 | 62.23,5.71 C7.1 | C8.1 43.82,11.75 53.02,11.75 55.56,14.29 55.88,14.29
  Bottom 0.813: 62.23,2.54 61.91,2.54 | 38.73,40.96 40.96,38.73 42.86,38.73 42.86,36.83 | 42.86,36.83 42.87,36.83 C5.1 42.86,36.83 | C6.+ 13.65,45.72 13.34,45.4 13.34,41.27 SV2.25
  Bottom 1.27: T3.1 73.66,2.22 73.34,1.91 62.23,1.91 61.91,2.22 | C6.+ 15.88,46.35 16.51,45.72 v17.78,45.72 v20.32,45.72 v22.86,45.72 v25.4,45.72 v27.94,45.72 v30.48,45.72 v33.02,45.72 v38.73,45.72 v50.8,45.72 v53.34,45.72 v55.88,45.72 v58.42,45.72 63.5,45.72 | v38.73,43.18 38.73,40.96
  Bottom 1.676: 10.8,2.22 41.27,2.22 61.91,2.22
VSS  (via drill 0.6 pad 1.68)  (1 unrouted)
  Top 0.406: v38.73,7.62 v38.73,17.78
  Top 0.508: v12.7,7.62 v15.24,7.62 v23.49,7.62 v26.04,7.62 v28.57,7.62 v31.11,7.62 v33.66,7.62 v36.2,7.62 v38.73,7.62
  Top 1.27: v59.05,6.35 v66.04,6.35 v68.58,6.35 v71.12,6.35 | v36.2,48.26 v36.2,43.18
  Bottom 0.406: IC1.5 42.89,34.09 | IC1.3 | v38.73,17.78 v38.73,20.32 40.32,21.91 40.96,21.91 41.27,22.23 41.27,23.5 42.14,24.36 IC1.21 | 44.77,42.55 44.77,44.45 36.2,44.45 v36.2,43.18
  Bottom 0.508: v71.12,6.35 72.39,5.08 74.61,5.08 75.25,5.71 75.25,7.94 U$3.P$3 | SV2.6 8.57,15.24 8.57,11.43 10.8,11.43 11.43,10.79 11.43,8.89 v12.7,7.62 | IC1.5 42.94,35.38 41.35,35.38 | IC1.3 41.27,34.21 41.27,35.3 41.35,35.38 | C5.2 40.96,37.15 40.96,36.83 40.96,35.78 41.35,35.38 | U1.9 45.7,10.13 45.09,9.53 C8.2 | C8.2 43.5,9.53 | U$7.1 64.64,43.69 64.77,43.81 64.77,48.58 | 71.76,40.01 71.78,40.03 U$6.1 72.29,39.69 73.03,39.69 73.66,39.05 74.93,39.05 76.52,37.47 76.52,35.88 77.79,34.61 | 77.15,13.02 77.15,13.97 76.2,14.92 76.2,16.83 75.88,17.14 74.3,17.14 74.32,17.17 U$1.1 | 85.09,22.86 84.77,22.54 | 85.09,23.18 80.65,23.18 80.33,23.5 79.56,23.5 C12.2 79.06,24.13 78.74,24.13 76.2,26.67 76.2,27.3 75.25,28.26 74.66,28.26 U$4.1 | U$5.1 74.58,33.97 75.25,33.97 75.88,33.34 75.88,32.07 76.52,31.43 76.52,30.8 77.47,29.84 79.06,29.84 | 79.06,29.84 C13.2 | 79.06,29.84 79.69,29.21 80.01,29.21 81.28,27.94 85.09,27.94 | 74.41,22.86 74.3,22.86 | 74.41,22.86 U$2.1 | C14.2 79.06,34.61 77.79,34.61 | 77.79,34.61 78.42,33.97 80.33,33.97 81.28,33.02 85.09,33.02 | 79.06,42.55 C15.2 | C10.2 77.79,12.57 77.79,12.38 | 74.41,22.86 75.57,22.86 76.2,22.23 76.2,21.27 77.47,20 77.47,19.68 78.11,19.05 | C11.2 79.06,19.05 78.11,19.05 | 78.11,19.05 78.42,18.73 80.01,18.73 80.96,17.78 85.09,17.78
  Bottom 0.61: 60.64,4.13 60.96,4.45 60.96,5.71 | 60.96,5.71 60.96,9.53 U2.2 | 60.96,5.71 C7.2 | 47.62,4.13 47.62,6.03 | 77.79,12.38 77.15,13.02 69.22,13.02 D1.3 | 44.77,42.55 C1.2
  Bottom 0.813: 60.64,4.13 47.62,4.13 43.18,4.13 43.18,8.89 | U$3.P$3 77.79,10.48 77.79,12.38 | v36.2,38.1 38.73,38.1 40.01,36.83 40.96,36.83 C5.2 | 11.75,42.86 11.75,42.23 SV2.26 | C8.2 43.18,8.89 | 43.18,8.89 38.73,8.89 v38.73,7.62
  Bottom 1.016: 75.57,42.55 79.06,42.55 84.77,42.55 85.09,42.23 85.09,33.02 85.09,27.94 85.09,23.18 85.09,22.86 85.09,17.78 85.09,8.57 76.52,8.57 U$3.P$3
  Bottom 1.27: C4.1 47.62,6.03 C3.1 | v59.05,6.35 59.69,5.71 C7.2 | C6.- 11.75,48.26 11.75,42.86 | v36.2,43.18 v36.2,40.64 v36.2,38.1 36.2,37.78 | 38.73,48.58 v36.2,48.26 | C2.2 44.77,42.55
  Bottom 1.422: SV2.26 SV2.24 SV2.22 SV2.20 SV2.18 SV2.16 SV2.14 SV2.12 SV2.10 SV2.8 SV2.6
  Bottom 1.676: 14.61,48.58 38.73,48.58 64.77,48.58 75.25,48.58 75.57,48.9 75.57,42.55
(copper drawn outside any net)
  shapes: Bottom area x67

### Text on the board
tOrigins: INT0 | TXD | RXD | VSS | RESET | MOSI | SCK | VIN | MISO
tNames: VCC_OUT
Measures: 49.53 | 39 | 33.4 | 25.4 | 48.26 | 16 | 17.4 | 4.8 | 1.27 | 0 | 16.89 | 40.64 | 64.39 | 81.28 | 47.5
tDocu: VSS | RESET | MOSI | SCK | VCC | MISO